# EAGLE design board (EAGLE 8.7.1)
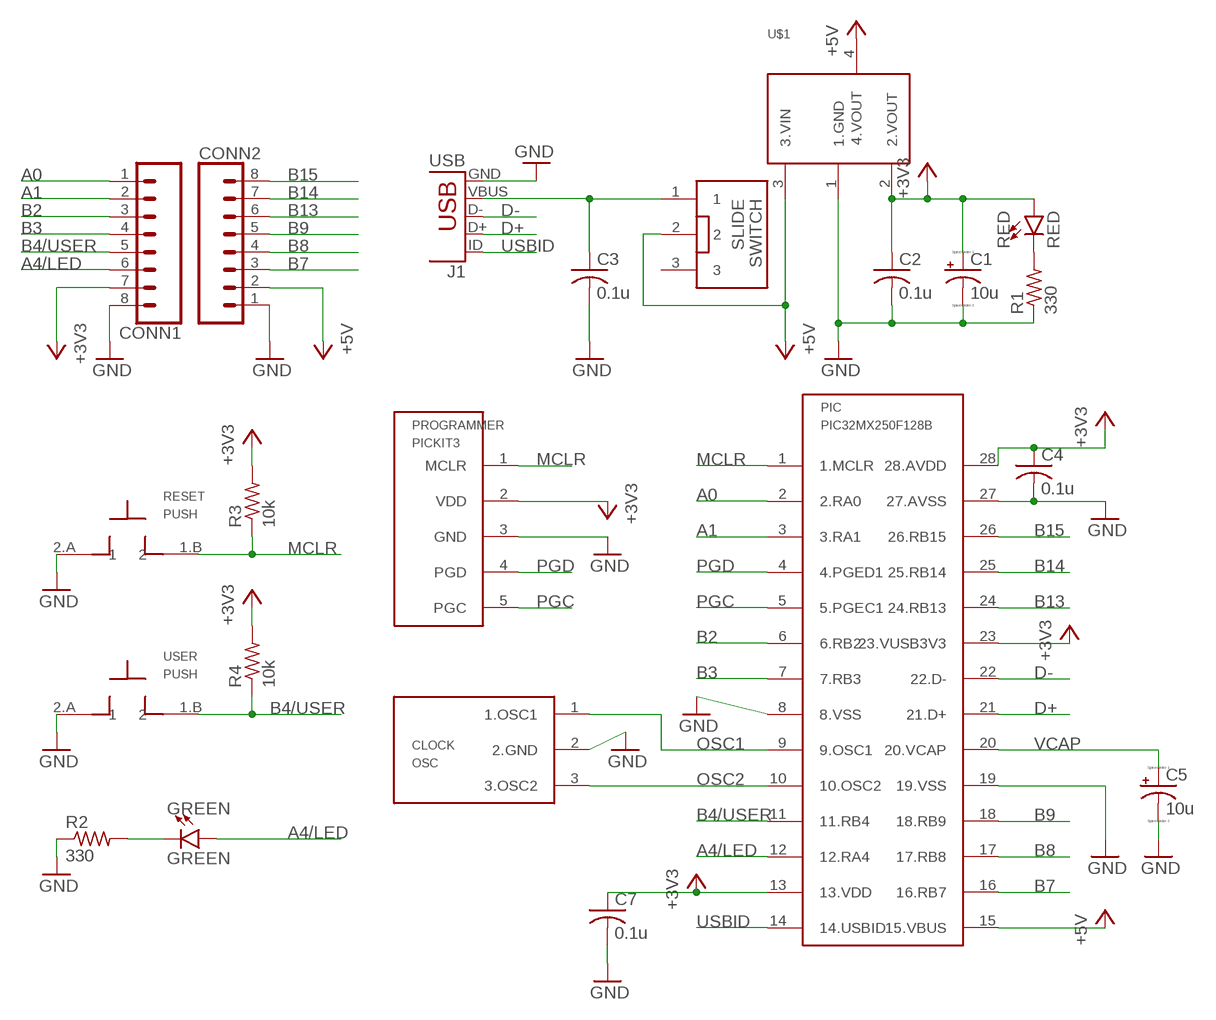
[diagram p0: schematic, sheet 1]

## Parts
C1  10u  CAP-POL  [CAP-POL-0603]
C2  0.1u  C-USC0603  [C0603]
C3  0.1u  C-USC0603  [C0603]
C4  0.1u  C-USC0603  [C0603]
C5  10u  CAP-POL  [CAP-POL-0603]
C7  0.1u  C-USC0603  [C0603]
CLOCK  OSC  [NU32V7_RESONATOR-SMD]
CONN1  CONN_08"  [1X08]
CONN2  CONN_08"  [1X08]
GREEN  GREEN  LED-GREEN0603  [LED-0603]
J1  USB  [NU32V7_USB-MINIB]
PIC  PIC32MX250F128B  [DIL28-3]
PROGRAMMER  PICKIT3  [1X05]
R1  330  R-US_R0603  [R0603]
R2  330  R-US_R0603  [R0603]
R3  10k  R-US_R0603  [R0603]
R4  10k  R-US_R0603  [R0603]
RED  RED  LED-RED0603  [LED-0603]
RESET  PUSH  [NU32V7_MOM_SW]
SWITCH  SLIDE  [SLIDE]
U$1  SOT-223  [NU32V7_SOT223]
USER  PUSH  [NU32V7_MOM_SW]

## Nets
+3V3: C1.1(+) C2.1 C4.1 C7.1 CONN1.7 PIC.13(13.VDD) PIC.23(23.VUSB3V3) PIC.28(28.AVDD) PROGRAMMER.2(VDD) R3.2 R4.2 RED.A U$1.2(2.VOUT)
+5V: CONN2.2 PIC.15(15.VBUS) SWITCH.2 U$1.3(3.VIN) U$1.4(4.VOUT)
A0: CONN1.1 PIC.2(2.RA0)
A1: CONN1.2 PIC.3(3.RA1)
A4/LED: CONN1.6 GREEN.A PIC.12(12.RA4)
B2: CONN1.3 PIC.6(6.RB2)
B3: CONN1.4 PIC.7(7.RB3)
B4/USER: CONN1.5 PIC.11(11.RB4) R4.1 USER.1.B
B7: CONN2.3 PIC.16(16.RB7)
B8: CONN2.4 PIC.17(17.RB8)
B9: CONN2.5 PIC.18(18.RB9)
B13: CONN2.6 PIC.24(24.RB13)
B14: CONN2.7 PIC.25(25.RB14)
B15: CONN2.8 PIC.26(26.RB15)
D+: J1.D+ PIC.21(21.D+)
D-: J1.D- PIC.22(22.D-)
GND: C1.2(-) C2.2 C3.2 C4.2 C5.2(-) C7.2 CLOCK.2(2.GND) CONN1.8 CONN2.1 J1.GND PIC.8(8.VSS) PIC.19(19.VSS) PIC.27(27.AVSS) PROGRAMMER.3(GND) R1.1 R2.1 RESET.2.A U$1.1(1.GND) USER.2.A
MCLR: PIC.1(1.MCLR) PROGRAMMER.1(MCLR) R3.1 RESET.1.B
N$1: GREEN.C R2.2
N$2: R1.2 RED.C
N$5: C3.1 J1.VBUS SWITCH.1
OSC1: CLOCK.1(1.OSC1) PIC.9(9.OSC1)
OSC2: CLOCK.3(3.OSC2) PIC.10(10.OSC2)
PGC: PIC.5(5.PGEC1) PROGRAMMER.5(PGC)
PGD: PIC.4(4.PGED1) PROGRAMMER.4(PGD)
USBID: J1.ID PIC.14(14.USBID)
VCAP: C5.1(+) PIC.20(20.VCAP)
Unconnected: SWITCH.3

## Library data of the parts
C1 = me433:CAP-POL
C2-C4 C7 = resistor:C-US: CAPACITOR, American symbol
C5 = me433:CAP-POL; SPICEPREFIX: C
CLOCK = me433:OSC
CONN1 CONN2 = me433:CONN_08: Multi connection point. Often used as Generic Header-pin footprint for 0.1 inch spaced/style header connections On any of the 0.1 inch spaced packages, you can populate with these: Break Away Headers - Straight <https://www.sparkfun.com/products/116> (PRT-00116) Break Away Male Headers - Right Angle <https://www.sparkfun.com/products/553> (PRT-00553) Female Headers <https://www.sparkfun.com/products/115> (PRT-00115) Break Away Headers - Machine Pin <https://www.sparkfun.com/products/117> (PRT-00117) Break Away Female Headers - Swiss Machine Pin <https://www.sparkfun.com/products/743> (PRT-00743) Arduino Stackable Header - 8 Pin <https://www.sparkfun.com/products/9279> (PRT-09279) For SCREWTERMINALS and SPRING TERMINALS visit here: Screw Terimnals on SparkFun.com <https://www.sparkfun.com/search/results?term=Screw+Terminals> (5mm/3.5mm/2.54mm spacing) This device is also useful as a general connection point to wire up your design to another part of your project. Our various solder wires solder well into these plated through hole pads. Hook-Up Wire - Assortment (Stranded, 22 AWG) <https://www.sparkfun.com/products/11375> (PRT-11375) Hook-Up Wire - Assortment (Solid Core, 22 AWG) <https://www.sparkfun.com/products/11367> (PRT-11367) View the entire wire category on our website here <https://www.sparkfun.com/categories/141> Special notes: Molex polarized connector foot print use with SKU : PRT-08231 with associated crimp pins and housings. 1MM SMD Version SKU: PRT-10208 NOTES ON THE VARIANTS LOCK and LOCK_LONGPADS... This footprint was designed to help hold the alignment of a through-hole component (i.e. 6-pin header) while soldering it into place. You may notice that each hole has been shifted either up or down by 0.005 of an inch from it's more standard position (which is a perfectly straight line). This slight alteration caused the pins (the squares in the middle) to touch the edges of the holes. Because they are alternating, it causes a "brace" to hold the component in place. 0.005 has proven to be the perfect amount of "off-center" position when using our standard breakaway headers. Although looks a little odd when you look at the bare footprint, once you have a header in there, the alteration is very hard to notice. Also,if you push a header all the way into place, it is covered up entirely on the bottom side.; PROD_ID: CONN-08438
GREEN = me433:LED-GREEN: Green SMD LED Used in manufacturing of various products at SparkFun Packages: 0603 - SMD 0603 package [Product Link] <http://www.futureelectronics.com/en/technologies/semiconductors/optoelectronics/leds/Pages/9894312-LTST-C190GKT.aspx?CrossPart=HSMG-C190&IM=0> LilyPad 1206 - SMD1206 LilyPad package [Product Link] <http://www.futureelectronics.com/en/Technologies/Product.aspx?ProductID=IN150NGHARVATEKCORPORATION2049943&IM=0> 1206 - SMD1206 package [Product Link] <http://www.futureelectronics.com/en/technologies/semiconductors/optoelectronics/leds/Pages/8315665-LTST-C150KGKT.aspx?IM=0> 1206 Bottom Mount -SMD 1206 Bottom Mount [Product Link] <http://www.digikey.com/product-detail/en/lite-on-inc/LTST-C230KGKT/160-1456-1-ND/386854> SparkFun Products: Pro Mini 328 -5V <https://www.sparkfun.com/products/821> RedBoard <https://www.sparkfun.com/products/12757> MP3 Trigger <https://www.sparkfun.com/products/13720> Makey Makey <https://www.sparkfun.com/products/11076>; PROD_ID: DIO-00821
J1 = me433:USB: USB Connectors USB-B-PTH is fully proven SKU : PRT-00139/CONN-08278 USB-miniB is fully proven SKU : PRT-00587 USB-A-PCB is untested. USB-A-H is throughly reviewed, but untested. Spark Fun Electronics SKU : PRT-00437 USB-B-SMT is throughly reviewed, but untested. Needs silkscreen touching up. USB-A-S has not been used/tested USB-MB-H has not been used/tested USB-MICROB has been used. CONN-09505; SPICEPREFIX: X
PIC = me433:PIC32MX250F128B
PROGRAMMER = me433:PICKIT3
R1 = resistor:R-US_: RESISTOR, American symbol; SPICEPREFIX: R
R2-R4 = resistor:R-US_: RESISTOR, American symbol
RED = me433:LED-RED: Red SMD LED Used in manufacturing of most products at SparkFun Packages: 0603 - SMD 0603 package [Product Link] <http://docs.avagotech.com/docs/AV02-0551EN> 0603 SMART - SMD 0603 SMART package ( more efficient and expensive)[Product Link] <http://www.osram-os.com/Graphics/XPic2/00077099_0.pdf> 1206 - SMD1206 package [Product Link] <https://www.sparkfun.com/datasheets/DevTools/LilyPad/Q150OVS4.pdff> SparkFun Products: Pro Mini 328 -5V <https://www.sparkfun.com/products/821> RedBoard <https://www.sparkfun.com/products/12757> IOIO-OTG <https://www.sparkfun.com/products/13613>; PROD_ID: DIO-00819; SPICEPREFIX: R
RESET USER = me433:PUSH
SWITCH = me433:SLIDE; SPICEPREFIX: J
U$1 = me433:SOT-223

## Board
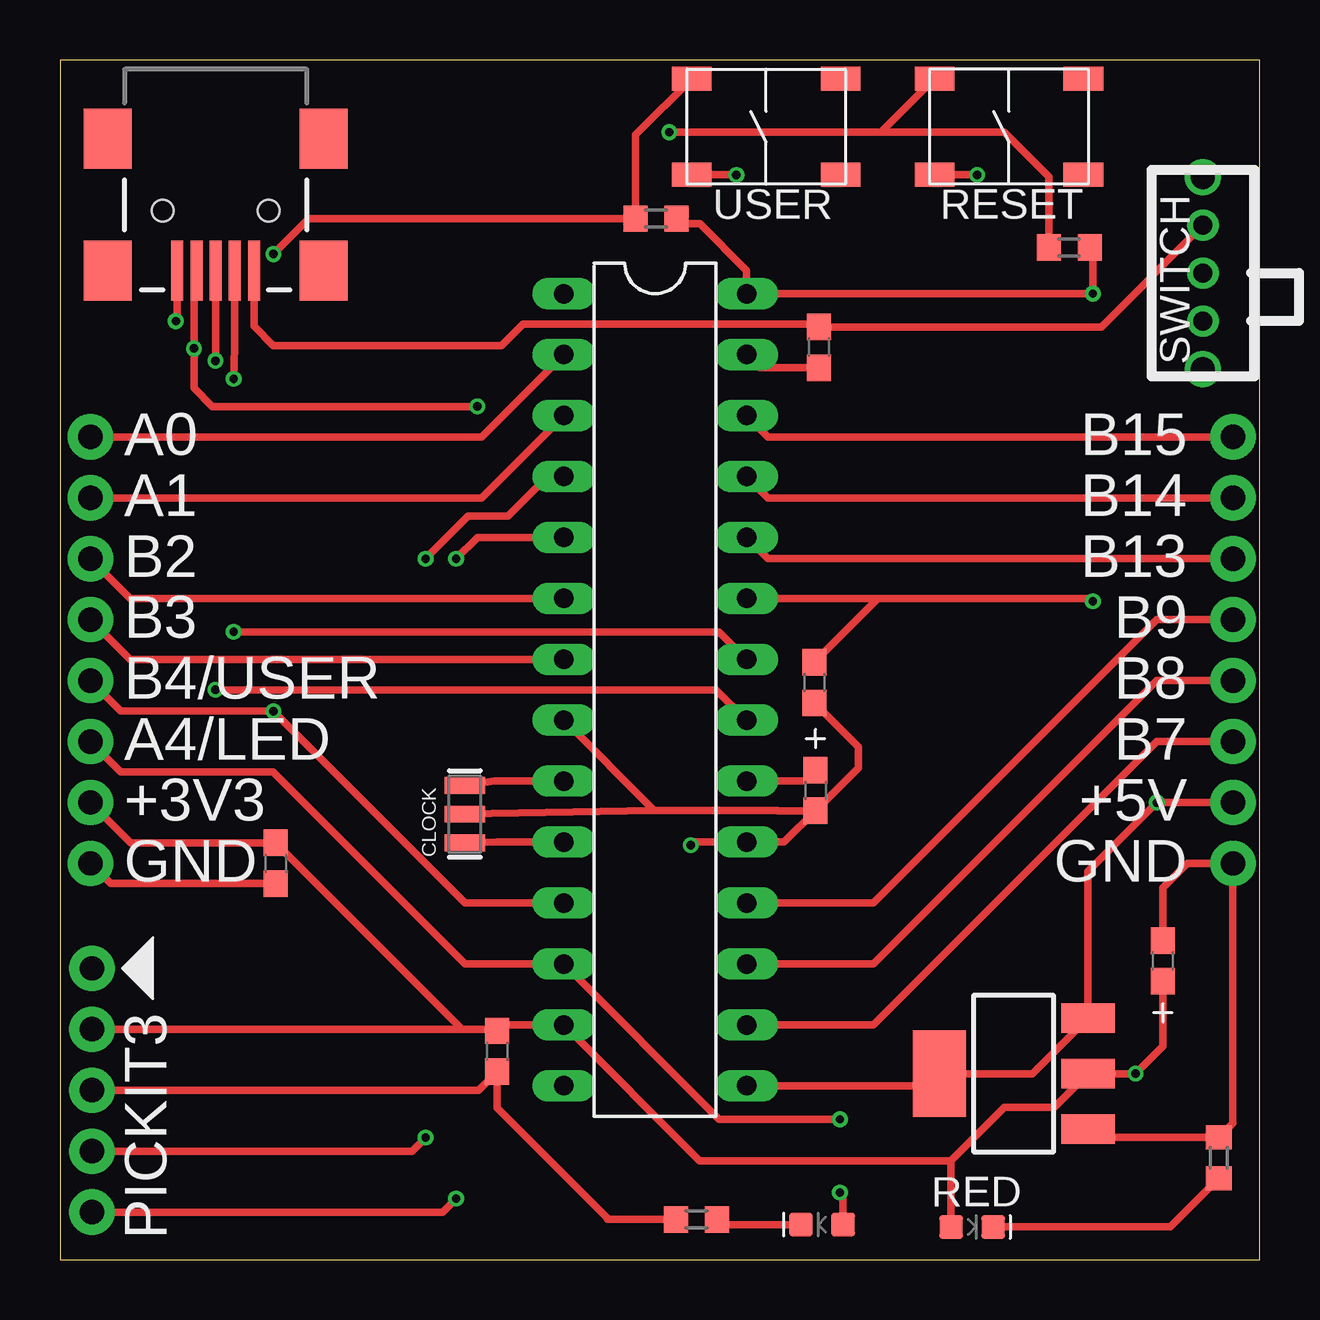
[diagram p1: board, top side]
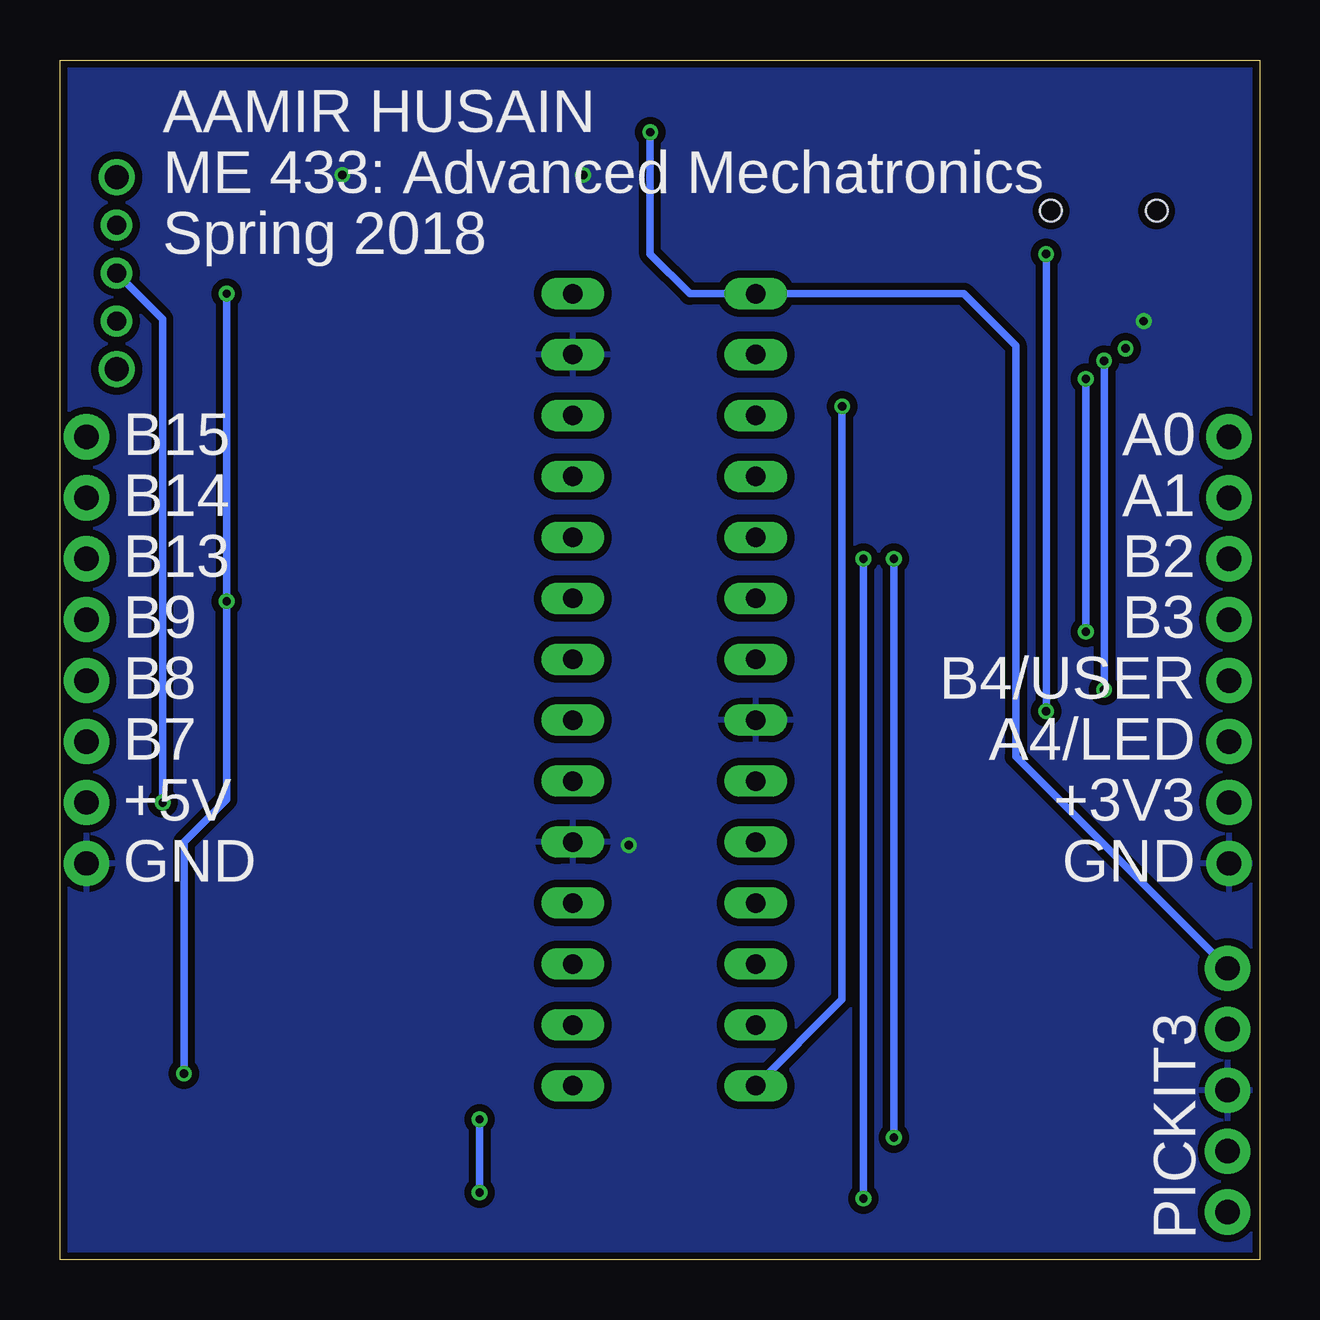
[diagram p2: board, bottom side, seen from below]

Size 50 x 50 mm. Coordinates in mm from the lower left corner, seen from the top.
Outline: 0,0 50,0 50,50 0,50 0,0
Copper layers (1*16): Top 0.035mm / dielectric 1.5mm / Bottom 0.035mm
Design rules "SeeedStudio_2layer_DRU_no_angle_20140221": minimum track width 6mil, minimum drill 12mil, track to track 6mil, track to pad 6mil, pad to pad 6mil, via to via 6mil, smd to smd 0mil, copper to edge 10mil, drill to drill 10mil, minimum pad ring 10mil, minimum via ring 6mil, stop-mask expansion 2mil, vias tented up to drill 100mil, thermal gap 10mil

### Footprints (pad centres in the part's own frame; a part is rotated, then mirrored left to right if it is on the bottom)
CAP-POL-0603 = smd 1.1 x 1: 1 -0.85,0; 2 0.85,0
C0603 = smd 1.1 x 1: 1 -0.85,0; 2 0.85,0
NU32V7_RESONATOR-SMD = smd 0.7 x 1.7: 1 -1.2,0; 2 0,0; 3 1.2,0
1X08 = drill 1.016 pad 1.88: 1 0,0; 2 2.54,0; 3 5.08,0; 4 7.62,0; 5 10.16,0; 6 12.7,0; 7 15.24,0; 8 17.78,0
LED-0603 = smd 1 x 1: A -0.877,0; C 0.877,0
NU32V7_USB-MINIB = smd 2.5 x 0.5: D+ 2.5,0; D- 2.5,0.8; GND 2.5,-1.6; ID 2.5,-0.8; VBUS 2.5,1.6 | smd 2.5 x 2: MTN1 -3,4.5; MTN2 2.5,4.5; MTN3 -3,-4.5; MTN4 2.5,-4.5 | hole 0.9: 0,2.2; 0,-2.2
DIL28-3 = drill 0.813 long: 1 -16.51,-3.81; 2 -13.97,-3.81; 3 -11.43,-3.81; 4 -8.89,-3.81; 5 -6.35,-3.81; 6 -3.81,-3.81; 7 -1.27,-3.81; 8 1.27,-3.81; 9 3.81,-3.81; 10 6.35,-3.81; 11 8.89,-3.81; 12 11.43,-3.81; 13 13.97,-3.81; 14 16.51,-3.81; 15 16.51,3.81; 16 13.97,3.81; 17 11.43,3.81; 18 8.89,3.81; 19 6.35,3.81; 20 3.81,3.81; 21 1.27,3.81; 22 -1.27,3.81; 23 -3.81,3.81; 24 -6.35,3.81; 25 -8.89,3.81; 26 -11.43,3.81; 27 -13.97,3.81; 28 -16.51,3.81
1X05 = drill 1.016 pad 1.88: 1 0,0; 2 2.54,0; 3 5.08,0; 4 7.62,0; 5 10.16,0
R0603 = smd 1 x 1.1: 1 -0.85,0; 2 0.85,0
NU32V7_MOM_SW = smd 1.65 x 1: 1.B -3.1,2; 2.A -3.1,-2; 3.A' 3.1,-2; 4.B' 3.1,2
SLIDE = drill 0.8: 1 -2,0; 2 0,0; 3 2,0 | drill 1: X1 -4,0; X2 4,0
NU32V7_SOT223 = smd 1.219 x 2.235: 1 -2.311,-3.099; 2 0,-3.099; 3 2.311,-3.099 | smd 3.6 x 2.2: 4 0,3.099

### Placement (x,y rotation side)
C1  45.97,12.45 90 top
C2  9,16.52 270 top
C3  31.63,38.02 270 top
C4  31.44,24.05 270 top
C5  31.49,19.55 270 top
C7  18.22,8.68 270 top
CLOCK  16.87,18.57 270 top
CONN1  1.27,34.29 270 top
CONN2  48.9,16.51 90 top
GREEN  31.76,1.46 180 top
J1  6.49,43.71 270 top
PIC  24.81,23.75 270 top
PROGRAMMER  1.33,12.14 270 top
R1  48.3,4.24 270 top
R2  26.53,1.67 0 top
R3  42.07,42.18 0 top
R4  24.84,43.39 0 top
RED  38.02,1.36 0 top
RESET  39.55,47.23 0 top
SWITCH  47.64,41.12 270 top
U$1  39.75,7.75 90 top
USER  29.44,47.22 0 top

### Tracks (layer width: path | path; a pad name or v marks a point on that pad's centre or on a via)
+3V3  (via drill 0.35)
  Top 0.305: 37.15,4.12 39.37,6.35 41.45,6.35 U$1.2 v44.83,7.75 45.97,8.89 C1.1 | 37.15,4.12 RED.A | 31.28,24.9 C4.1 34.1,27.56 | PIC.23 34.1,27.56 | 34.1,27.56 42.92,27.56 v43.05,27.43 | 37.15,4.12 26.66,4.12 PIC.13 18.46,9.78 C7.1 18.15,9.6 16.77,9.6 | PROGRAMMER.2 16.77,9.6 | PIC.28 v43.05,40.26 43.05,42.05 R3.2 | PIC.28 | R4.2 25.9,43.18 26.67,43.18 28.62,41.23 PIC.28 | CONN1.7 2.95,17.37 C2.1 16.77,9.6
  Bottom 0.305: v44.83,7.75 44.83,17.4 43.05,19.18 v43.05,27.43 v43.05,40.26
+5V  (via drill 0.35)
  Top 0.305: 48.9,18.64 CONN2.2 v45.72,19.05 42.85,16.18 U$1.3 40.54,7.75 36.83,7.75 | 36.83,7.75 U$1.4 | PIC.15 36.32,7.24 36.83,7.75
  Bottom 0.305: v45.72,19.05 45.72,39.2 SWITCH.2
A0
  Top 0.305: CONN1.1 17.57,34.29 PIC.2
A1
  Top 0.305: PIC.3 17.57,31.75 CONN1.2
A4/LED  (via drill 0.35)
  Top 0.305: CONN1.6 2.54,20.32 8.89,20.32 16.89,12.32 PIC.12 27.48,5.84 v32.51,5.84 | v32.51,2.79 32.64,2.67 GREEN.A
  Bottom 0.305: v32.51,5.84 v32.51,2.79
B2
  Top 0.305: CONN1.3 2.92,27.56 PIC.6
B3
  Top 0.305: CONN1.4 2.92,25.02 PIC.7
B4/USER  (via drill 0.35)
  Top 0.305: CONN1.5 2.54,22.86 v8.89,22.86 16.89,14.86 PIC.11 | USER.1.B 23.99,46.88 R4.1 10.37,43.39 v8.89,41.91
  Bottom 0.305: v8.89,41.91 v8.89,22.86
B7
  Top 0.305: PIC.16 33.91,9.78 45.72,21.59 CONN2.3
B8
  Top 0.305: PIC.17 33.91,12.32 45.72,24.13 CONN2.4
B9
  Top 0.305: PIC.18 33.91,14.86 45.72,26.67 CONN2.5
B13
  Top 0.305: PIC.24 29.51,29.21 CONN2.6
B14
  Top 0.305: PIC.25 29.51,31.75 CONN2.7
B15
  Top 0.305: PIC.26 29.51,34.29 CONN2.8
D+  (via drill 0.35)
  Top 0.305: J1.D+ 6.49,37.99 v6.48,37.47 | v6.48,23.75 27.35,23.75 PIC.21
  Bottom 0.305: v6.48,37.47 v6.48,23.75
D-  (via drill 0.35)
  Top 0.305: J1.D- 7.29,38.02 v7.24,36.7 | v7.24,26.16 27.48,26.16 PIC.22
  Bottom 0.305: v7.24,36.7 v7.24,26.16
GND  (via drill 0.35)
  Top 0.305: U$1.1 43.2,5.08 R1.1 48.9,5.68 CONN2.1 46.99,16.51 45.97,15.49 C1.2 | C3.2 29.17,37.17 PIC.27 | C5.2 29.92,18.7 29.91,18.72 24.76,18.72 | CLOCK.2 24.76,18.72 | C5.2 33.27,20.49 33.27,21.37 C4.2 | 22.83,1.67 22.86,1.67 | 22.86,1.67 R2.1 | J1.GND 4.89,39.18 v4.83,39.12 | RESET.2.A 38.21,45.23 v38.23,45.21 | USER.2.A v28.19,45.22 v28.19,45.21 | C5.2 30.19,17.4 PIC.19 26.42,17.4 v26.29,17.27 | 22.86,1.67 18.22,6.31 C7.2 17.44,7.06 PROGRAMMER.3 | PIC.8 24.76,18.72 | CONN1.8 2.11,15.67 C2.2
  pour Bottom (isolate 0.305): -0.25,50.55 49.28,50.55 50.8,49.53 50.55,-0.13 49.53,-0.64 0,-0.64 -0.64,0 -0.64,49.53
MCLR  (via drill 0.35)
  Top 0.305: v25.4,46.99 34.22,46.99 | 34.22,46.99 RESET.1.B | R3.1 41.22,45.14 39.37,46.99 34.22,46.99
  Bottom 0.305: PROGRAMMER.1 10.16,20.96 10.16,38.1 12.32,40.26 PIC.1 23.75,40.26 25.4,41.91 v25.4,46.99
N$1
  Top 0.305: R2.2 27.6,1.46 GREEN.C
N$2
  Top 0.305: R1.2 46.27,1.36 RED.C
N$5
  Top 0.305: J1.VBUS 8.09,38.9 8.89,38.1 18.41,38.1 19.3,38.99 31.51,38.99 C3.1 43.4,38.87 SWITCH.1
OSC1
  Top 0.305: PIC.9 18.12,19.94 CLOCK.1
OSC2
  Top 0.305: PIC.10 18.21,17.4 CLOCK.3
PGC  (via drill 0.35)
  Top 0.305: PROGRAMMER.5 15.95,1.98 v16.51,2.54 | v16.51,29.21 17.4,30.1 PIC.5
  Bottom 0.305: v16.51,2.54 v16.51,29.21
PGD  (via drill 0.35)
  Top 0.305: PROGRAMMER.4 14.68,4.52 v15.24,5.08 | v15.24,29.21 17.02,30.99 18.67,30.99 20.32,32.64 PIC.4
  Bottom 0.305: v15.24,5.08 v15.24,29.21
USBID  (via drill 0.35)
  Top 0.305: J1.ID 5.59,41.11 v5.59,37.97 5.59,36.32 6.35,35.56 v17.4,35.56 17.53,35.56
  Bottom 0.305: v17.4,35.56 17.4,10.84 PIC.14
VCAP
  Top 0.305: C5.1 31.03,19.94 PIC.20

### Text on the board
tPlace: A0 | B15 | A1 | B14 | B2 | B13 | B3 | B9 | B4/USER | B8 | A4/LED | B7 | +3V3 | +5V | GND | GND | PICKIT3
bPlace: AAMIR HUSAIN | ME 433: Advanced Mechatronics | Spring 2018 | A0 | B15 | A1 | B14 | B2 | B13 | B3 | B9 | B4/USER | B8 | A4/LED | B7 | +3V3 | +5V | GND | GND | PICKIT3